# Altium schematic sheet [3]-ROTARY_ENCODER.SchDoc
size A3; SheetNumber: 4; SheetTotal: 8
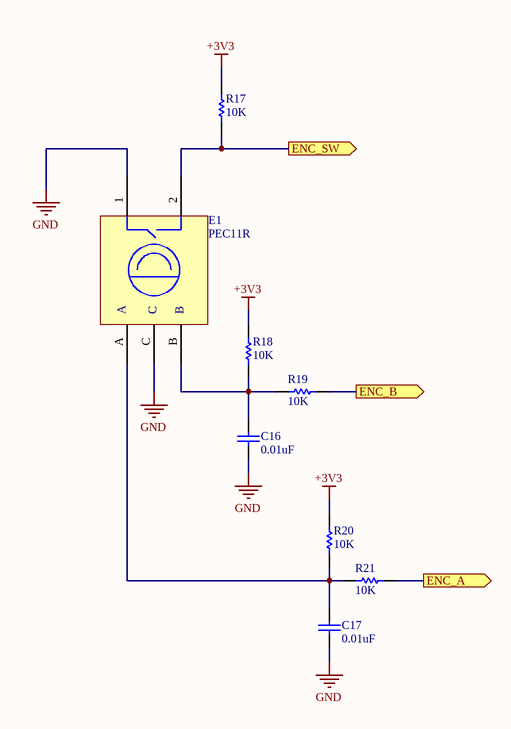
[diagram p0: [3]-ROTARY_ENCODER.SchDoc]

## Parts
C16  0.01uF  [CAPC1608N]
C17  0.01uF  [CAPC1608N]
E1  PEC11R  [PEC11R]
R17  10K  [RESC1608N]
R18  10K  [RESC1608N]
R19  10K  [RESC1608N]
R20  10K  [RESC1608N]
R21  10K  [RESC1608N]

## Ports
ENC_A (out), ENC_B (out), ENC_SW (out)

## Nets
+3V3: R17.2 R18.2 R20.2
GND: C16.1 C17.1 E1.1 E1.C
ENC_A: R21.1 ; port ENC_A
ENC_B: R19.1 ; port ENC_B
ENC_SW: E1.2 R17.1 ; port ENC_SW
NetC16_2: C16.2 E1.B R18.1 R19.2
NetC17_2: C17.2 E1.A R20.1 R21.2

## Library data of the parts
C16 C17 = 06035C-103KAT2A: CAP CER 10000PF 50V X7R 0603; Manufacturer 1: Kyocera AVX; Dielectric Material: Ceramic; Tolerance: 10%; Capacitance: 10nF; Dissipation Factor: 2.5%; Insulation Resistance: 100GR; Supplier 1: Digi-Key; Manufacturer Part Number 1: 06035C-103KAT2A; Stock 1: 40000; Pricing 1: 1=0.1, 10=0.075, 100=0.0334, 500=0.02388, 1000=0.01877 (USD); Mount: Surface Mount,PCB; Case/Package: 0603; Number of Pins: 2; Case Code (Metric): 1608; Case Code (Imperial): 0603; Contact Plating: Tin,Matte; Min Operating Temperature: -55°C; Max Operating Temperature: 125°C; Dielectric: X7R; Voltage Rating (DC): 50V; Packaging: Tape and Reel; Voltage: 50V; Voltage Rating: 50V; Package Quantity: 1; Termination: SMD/SMT; Length: 1.6mm; Height: 0.9mm; Width: 0.032inch; Depth: 0.81mm; Thickness: 0.035inch; Radiation Hardening: No; REACH SVHC: No SVHC; Lead Free: Lead Free; ComponentLink1URL: https://datasheet.ciiva.com/1124/1679506-1124848.pdf; ComponentLink1Description: https://datasheet.ciiva.com/1124/1679506-1124848.pdf; ComponentLink2URL: https://datasheet.ciiva.com/2987/cx7r-2987824.pdf; ComponentLink2Description: https://datasheet.ciiva.com/2987/cx7r-2987824.pdf; ComponentLink3URL: https://datasheet.ciiva.com/150/cx7r-150227.pdf; ComponentLink3Description: https://datasheet.ciiva.com/150/cx7r-150227.pdf; ComponentLink4URL: https://datasheet.ciiva.com/150/cx7r-150228.pdf; ComponentLink4Description: https://datasheet.ciiva.com/150/cx7r-150228.pdf; ComponentLink5URL: https://datasheet.ciiva.com/150/cx7r-150229.pdf; ComponentLink5Description: https://datasheet.ciiva.com/150/cx7r-150229.pdf; ComponentLink6URL: https://datasheet.ciiva.com/16209/cx7r-16209238.pdf; ComponentLink6Description: https://datasheet.ciiva.com/16209/cx7r-16209238.pdf; ComponentLink7URL: https://datasheet.ciiva.com/15212/getdatasheetpartid-87506-15212295.pdf; ComponentLink7Description: https://datasheet.ciiva.com/15212/getdatasheetpartid-87506-15212295.pdf; ComponentLink8URL: https://datasheet.ciiva.com/5423/cx7r-218113-5423178.pdf; ComponentLink8Description: https://datasheet.ciiva.com/5423/cx7r-218113-5423178.pdf; ComponentLink9URL: https://datasheet.ciiva.com/7855/1679506-7855082.pdf; ComponentLink9Description: https://datasheet.ciiva.com/7855/1679506-7855082.pdf; ComponentLink10URL: https://datasheet.ciiva.com/14585/70001075-14585146.pdf; ComponentLink10Description: https://datasheet.ciiva.com/14585/70001075-14585146.pdf; ComponentLink11URL: https://datasheet.ciiva.com/25901/cx7r-25901100.pdf; ComponentLink11Description: https://datasheet.ciiva.com/25901/cx7r-25901100.pdf; ComponentLink12URL: https://datasheet.ciiva.com/1124/1679506-1124847.pdf; ComponentLink12Description: https://datasheet.ciiva.com/1124/1679506-1124847.pdf; ComponentLink13URL: https://datasheet.ciiva.com/2987/cx7r-2987823.pdf; ComponentLink13Description: https://datasheet.ciiva.com/2987/cx7r-2987823.pdf; Supplier Part Number 1: 478-1227-1-ND
E1 = PEC11R-4215F-S0024: ENCODER ROTARY 15MM SHAFT; Manufacturer 1: Bourns; Number of Channels: 2; Encoder Type: Mechanical; Pulses per Revolution: 24; Detent: Yes; Output Type: Quadrature,Incremental; Hole Diameter: 1.8mm; Supplier 1: Digi-Key; Manufacturer Part Number 1: PEC11R-4215F-S0024; Stock 1: 2746; Pricing 1: 1=1.68, 10=1.566, 25=1.4792, 50=1.305, 150=1.073, 300=1.044, 600=0.986, 1050=0.928, 5100=0.812 (USD); Mount: Through Hole,Panel,PCB; Min Operating Temperature: -30°C; Max Operating Temperature: 70°C; Package Quantity: 150; Packaging: Bulk; Termination: PC Pins; Orientation: Vertical; Built in Switch: Yes; Type: Mechanical; Length: 21.5mm; Height: 13.4mm; Width: 12.5mm; Radiation Hardening: No; REACH SVHC: No SVHC; ComponentLink1URL: https://datasheet.ciiva.com/26917/getdatasheetpartid-730131-26917851.pdf; ComponentLink1Description: https://datasheet.ciiva.com/26917/getdatasheetpartid-730131-26917851.pdf; ComponentLink2URL: https://datasheet.ciiva.com/12175/pec11r-221203-12175422.pdf; ComponentLink2Description: https://datasheet.ciiva.com/12175/pec11r-221203-12175422.pdf; Supplier Part Number 1: PEC11R-4215F-S0024-ND
R17-R21 = AC0603JR-0710KL: RES SMD 10K OHM 5% 1/10W 0603; Manufacturer 1: Yageo; Voltage Rating: 50V; Resistance: 10kR; Power Rating: 100mW; Temperature Coefficient: 100ppm/°C; Supplier 1: Digi-Key; Manufacturer Part Number 1: AC0603JR-0710KL; Stock 1: 60451; Pricing 1: 1=0.1, 10=0.032, 100=0.0131, 1000=0.00588, 2500=0.0051 (USD); Case/Package: 0603; Case Code (Imperial): 0603; Case Code (Metric): 1608; Min Operating Temperature: -55°C; Max Operating Temperature: 155°C; Packaging: Tape and Reel; Tolerance: 5%; Package Quantity: 1; Composition: Thick Film; Termination: SMD/SMT; Number of Terminations: 2; Military Standard: Not; Max Power Dissipation: 100mW; Features: Moisture Resistant,Automotive AEC-Q200,Anti-Sulfur; Length: 0.063inch; Height: 0.022inch; Width: 0.031inch; Depth: 0.8mm; Lead Free: Lead Free; ComponentLink1URL: https://datasheet.ciiva.com/5562/pyu-ac-51-rohs-l-2-5562553.pdf; ComponentLink1Description: https://datasheet.ciiva.com/5562/pyu-ac-51-rohs-l-2-5562553.pdf; Supplier Part Number 1: 311-10KLECT-ND